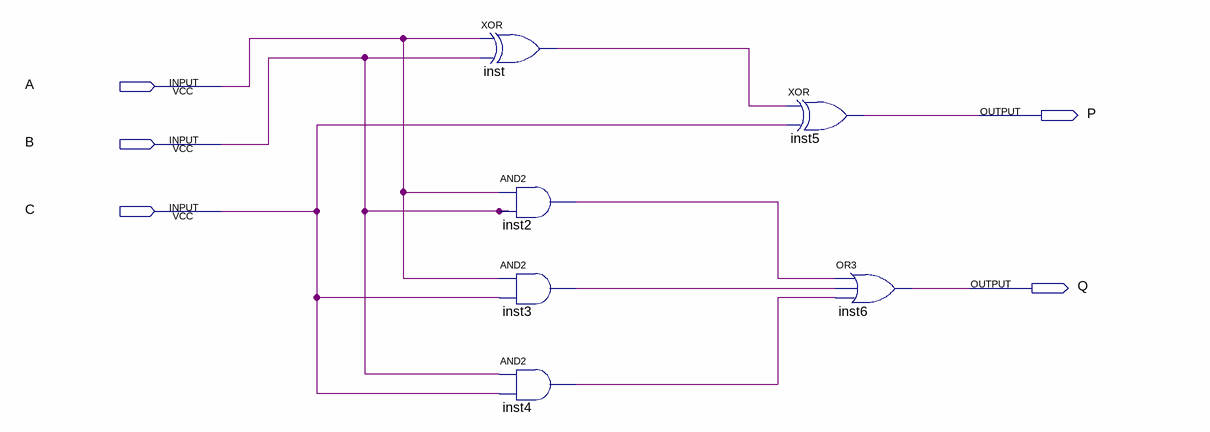
[diagram p0: schematic sheet]
// Quartus schematic Lab2Adder.bdf as structural Verilog: 6 symbols, 5 pins
module Lab2Adder (
  input  A,
  input  B,
  input  C,
  output P,
  output Q
);

  wire inst2_out, inst3_out, inst4_out, inst_out;

  xor inst (inst_out, A, B);
  and inst2 (inst2_out, A, B);
  and inst3 (inst3_out, A, C);
  and inst4 (inst4_out, B, C);
  xor inst5 (P, inst_out, C);
  or inst6 (Q, inst2_out, inst3_out, inst4_out);
endmodule
